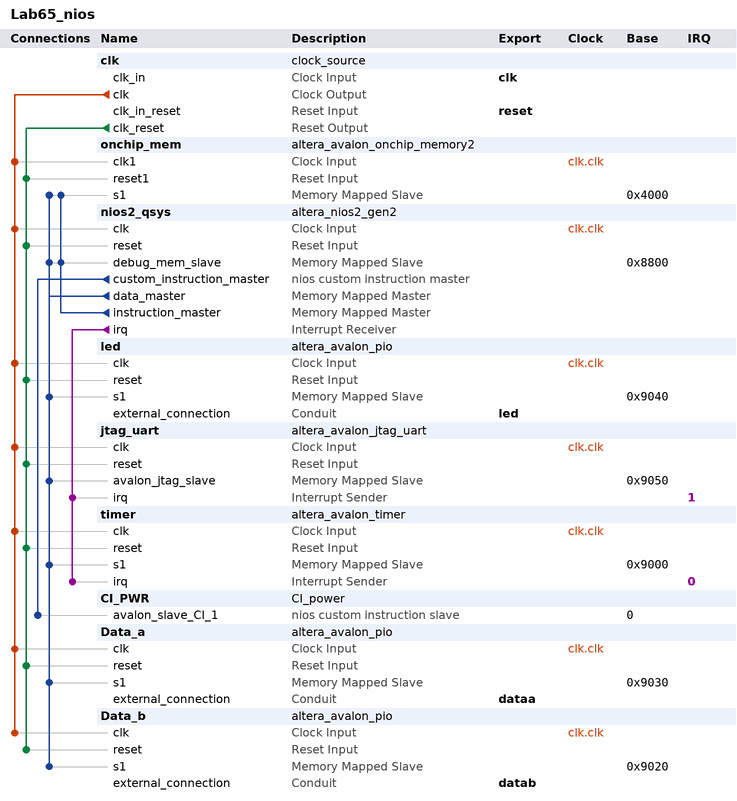
[diagram p0: system contents]
# Platform Designer (Qsys) system Lab65_nios, Cyclone V 5CEBA2F17C8
# Parameters at their usual value, and those the tool derives, are not listed.
package require -exact qsys 18.1
create_system Lab65_nios
set_project_property DEVICE_FAMILY {Cyclone V}
set_project_property DEVICE 5CEBA2F17C8

add_instance clk clock_source 18.1
set_instance_parameter_value clk clockFrequency 25000000
set_instance_parameter_value clk resetSynchronousEdges DEASSERT

add_instance onchip_mem altera_avalon_onchip_memory2 18.1
set_instance_parameter_value onchip_mem dataWidth 32
set_instance_parameter_value onchip_mem dualPort false
set_instance_parameter_value onchip_mem initMemContent true
set_instance_parameter_value onchip_mem initializationFileName onchip_mem.hex
set_instance_parameter_value onchip_mem memorySize 16384
set_instance_parameter_value onchip_mem useNonDefaultInitFile true

add_instance nios2_qsys altera_nios2_gen2 18.1
set_instance_parameter_value nios2_qsys dcache_size 2048
set_instance_parameter_value nios2_qsys exceptionSlave onchip_mem.s1
set_instance_parameter_value nios2_qsys icache_size 4096
set_instance_parameter_value nios2_qsys impl Tiny
set_instance_parameter_value nios2_qsys resetSlave onchip_mem.s1

add_instance led altera_avalon_pio 18.1
set_instance_parameter_value led direction Output
set_instance_parameter_value led width 8

add_instance jtag_uart altera_avalon_jtag_uart 18.1
set_instance_parameter_value jtag_uart simInteractiveOptions NO_INTERACTIVE_WINDOWS
set_instance_parameter_value jtag_uart useRegistersForReadBuffer true
set_instance_parameter_value jtag_uart useRegistersForWriteBuffer true

add_instance timer altera_avalon_timer 18.1
set_instance_parameter_value timer period 1
set_instance_parameter_value timer periodUnits MSEC

add_instance CI_PWR CI_power 1.0

add_instance Data_a altera_avalon_pio 18.1
set_instance_parameter_value Data_a direction Input
set_instance_parameter_value Data_a width 4

add_instance Data_b altera_avalon_pio 18.1
set_instance_parameter_value Data_b direction Input
set_instance_parameter_value Data_b width 4

# connections
add_connection clk.clk Data_a.clk clock
add_connection clk.clk Data_b.clk clock
add_connection clk.clk jtag_uart.clk clock
add_connection clk.clk led.clk clock
add_connection clk.clk nios2_qsys.clk clock
add_connection clk.clk onchip_mem.clk1 clock
add_connection clk.clk timer.clk clock
add_connection clk.clk_reset Data_a.reset reset
add_connection clk.clk_reset Data_b.reset reset
add_connection clk.clk_reset jtag_uart.reset reset
add_connection clk.clk_reset led.reset reset
add_connection clk.clk_reset nios2_qsys.reset reset
add_connection clk.clk_reset onchip_mem.reset1 reset
add_connection clk.clk_reset timer.reset reset
add_connection nios2_qsys.data_master Data_a.s1 avalon
set_connection_parameter_value nios2_qsys.data_master/Data_a.s1 baseAddress 0x9030
add_connection nios2_qsys.data_master Data_b.s1 avalon
set_connection_parameter_value nios2_qsys.data_master/Data_b.s1 baseAddress 0x9020
add_connection nios2_qsys.data_master jtag_uart.avalon_jtag_slave avalon
set_connection_parameter_value nios2_qsys.data_master/jtag_uart.avalon_jtag_slave baseAddress 0x9050
add_connection nios2_qsys.data_master led.s1 avalon
set_connection_parameter_value nios2_qsys.data_master/led.s1 baseAddress 0x9040
add_connection nios2_qsys.data_master nios2_qsys.debug_mem_slave avalon
set_connection_parameter_value nios2_qsys.data_master/nios2_qsys.debug_mem_slave baseAddress 0x8800
add_connection nios2_qsys.data_master onchip_mem.s1 avalon
set_connection_parameter_value nios2_qsys.data_master/onchip_mem.s1 baseAddress 0x4000
add_connection nios2_qsys.data_master timer.s1 avalon
set_connection_parameter_value nios2_qsys.data_master/timer.s1 baseAddress 0x9000
add_connection nios2_qsys.instruction_master nios2_qsys.debug_mem_slave avalon
set_connection_parameter_value nios2_qsys.instruction_master/nios2_qsys.debug_mem_slave baseAddress 0x8800
add_connection nios2_qsys.instruction_master onchip_mem.s1 avalon
set_connection_parameter_value nios2_qsys.instruction_master/onchip_mem.s1 baseAddress 0x4000
add_connection nios2_qsys.irq jtag_uart.irq interrupt
set_connection_parameter_value nios2_qsys.irq/jtag_uart.irq irqNumber 1
add_connection nios2_qsys.irq timer.irq interrupt
set_connection_parameter_value nios2_qsys.irq/timer.irq irqNumber 0
add_connection nios2_qsys.custom_instruction_master CI_PWR.avalon_slave_CI_1 nios_custom_instruction
set_connection_parameter_value nios2_qsys.custom_instruction_master/CI_PWR.avalon_slave_CI_1 CIName ci_pwr
set_connection_parameter_value nios2_qsys.custom_instruction_master/CI_PWR.avalon_slave_CI_1 baseAddress 0

# exported interfaces
add_interface clk clock sink
set_interface_property clk EXPORT_OF clk.clk_in
add_interface dataa conduit end
set_interface_property dataa EXPORT_OF Data_a.external_connection
add_interface datab conduit end
set_interface_property datab EXPORT_OF Data_b.external_connection
add_interface led conduit end
set_interface_property led EXPORT_OF led.external_connection
add_interface reset reset sink
set_interface_property reset EXPORT_OF clk.clk_in_reset

set_interconnect_requirement {$system} qsys_mm.clockCrossingAdapter HANDSHAKE
set_interconnect_requirement {$system} qsys_mm.enableEccProtection FALSE
set_interconnect_requirement {$system} qsys_mm.insertDefaultSlave FALSE
set_interconnect_requirement {$system} qsys_mm.maxAdditionalLatency 1

save_system Lab65_nios.qsys
